# Altium project Week1.PrjPcb
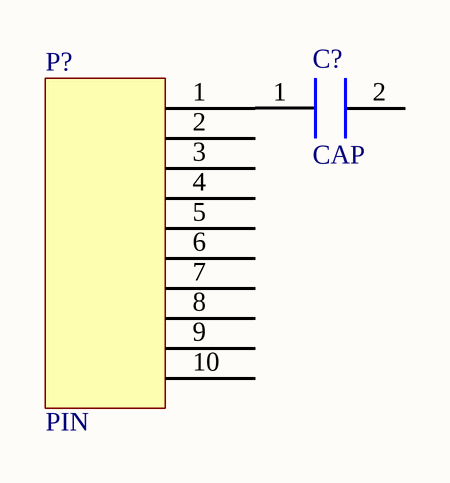
[diagram p0: week.SchDoc]
1 sheet, 2 parts. Net scope: global (net labels, ports and power ports of the same name join across sheets).
Board file: week1.PcbDoc

## Sheet week.SchDoc
size A3

### Parts
C?  CAP
P?  PIN

### Nets
NetC?_1: C?.1 P?.1

Not connected (* = marked no-connect by the designer): C? 2; P? 2 3 4 5 6 7 8 9 10

### Library data of the parts
C? = CAP: 电容
P? = PIN: 排针